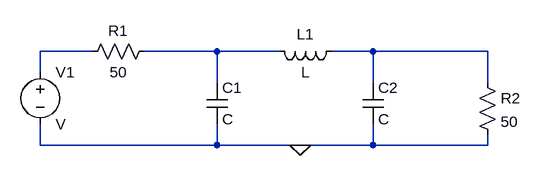
[diagram p0: schematic Draft7.asc]
Draft7.asc, the LTspice schematic file:
Version 4
SHEET 1 880 680
WIRE -96 256 -176 256
WIRE 96 256 -16 256
WIRE 192 256 96 256
WIRE 336 256 272 256
WIRE 512 256 336 256
WIRE -176 288 -176 256
WIRE 96 304 96 256
WIRE 336 304 336 256
WIRE 512 304 512 256
WIRE -176 400 -176 368
WIRE 96 400 96 368
WIRE 96 400 -176 400
WIRE 224 400 96 400
WIRE 336 400 336 368
WIRE 336 400 224 400
WIRE 512 400 512 384
WIRE 512 400 336 400
FLAG 224 400 0
SYMBOL Voltage -176 272 R0
SYMATTR InstName V1
SYMBOL Res 0 240 R90
WINDOW 0 0 56 VBottom 2
WINDOW 3 32 56 VTop 2
SYMATTR InstName R1
SYMATTR Value 50
SYMBOL Ind 288 240 R90
WINDOW 0 5 56 VBottom 2
WINDOW 3 32 56 VTop 2
SYMATTR InstName L1
SYMBOL Cap 80 304 R0
SYMATTR InstName C1
SYMBOL Cap 320 304 R0
SYMATTR InstName C2
SYMBOL Res 496 288 R0
SYMATTR InstName R2
SYMATTR Value 50

The netlist it stands for:
* Draft7.asc
V1 N001 0 V
R1 N002 N001 50
L1 N003 N002 L
C1 N002 0 C
C2 N003 0 C
R2 N003 0 50
.backanno
.end